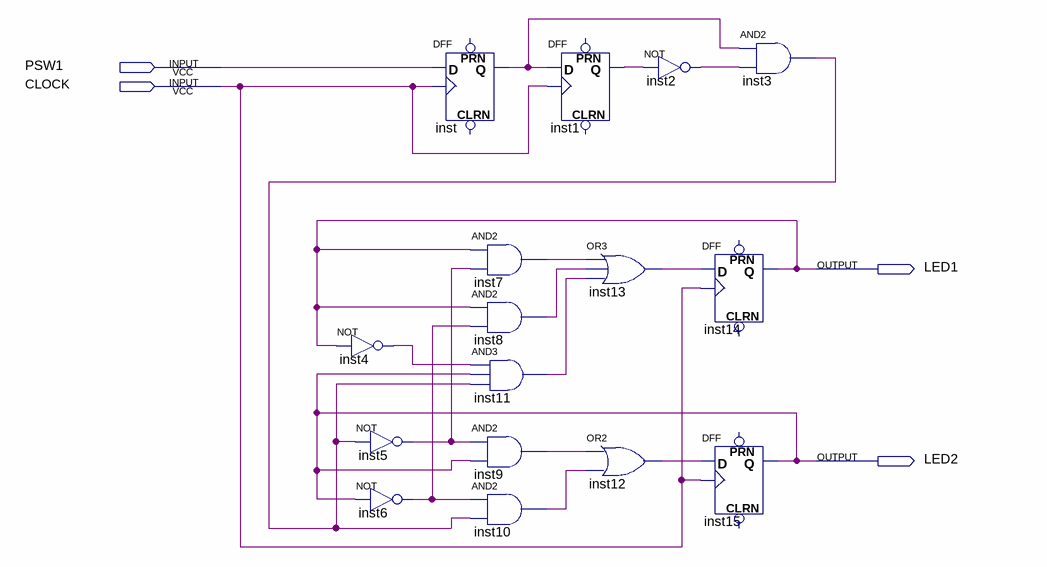
[diagram p0: schematic sheet]
// Quartus schematic q3.bdf as structural Verilog: 16 symbols, 4 pins
module q3 (
  input  PSW1,
  input  CLOCK,
  output LED1,
  output LED2
);

  wire inst1_q, inst2_out, inst3_out, inst4_out, inst5_out, inst6_out, inst7_out, inst8_out, inst9_out,
       inst10_out, inst11_out, inst12_out, inst13_out, inst_q;

  not inst4 (inst4_out, LED1);
  not inst5 (inst5_out, inst3_out);
  not inst6 (inst6_out, LED2);
  DFF inst (.CLK(CLOCK), .D(PSW1), .Q(inst_q));  // open: CLRN, PRN
  and inst7 (inst7_out, LED1, inst5_out);
  and inst8 (inst8_out, LED1, inst6_out);
  and inst11 (inst11_out, inst4_out, LED2, inst3_out);
  and inst9 (inst9_out, inst5_out, LED2);
  and inst10 (inst10_out, inst6_out, inst3_out);
  DFF inst1 (.CLK(CLOCK), .D(inst_q), .Q(inst1_q));  // open: CLRN, PRN
  or inst13 (inst13_out, inst7_out, inst8_out, inst11_out);
  or inst12 (inst12_out, inst9_out, inst10_out);
  not inst2 (inst2_out, inst1_q);
  and inst3 (inst3_out, inst_q, inst2_out);
  DFF inst14 (.CLK(CLOCK), .D(inst13_out), .Q(LED1));  // open: CLRN, PRN
  DFF inst15 (.CLK(CLOCK), .D(inst12_out), .Q(LED2));  // open: CLRN, PRN
endmodule
